# EasyEDA Pro project ProPrj_STM32电源板第二版_2025-04-22.epro, board PCB1
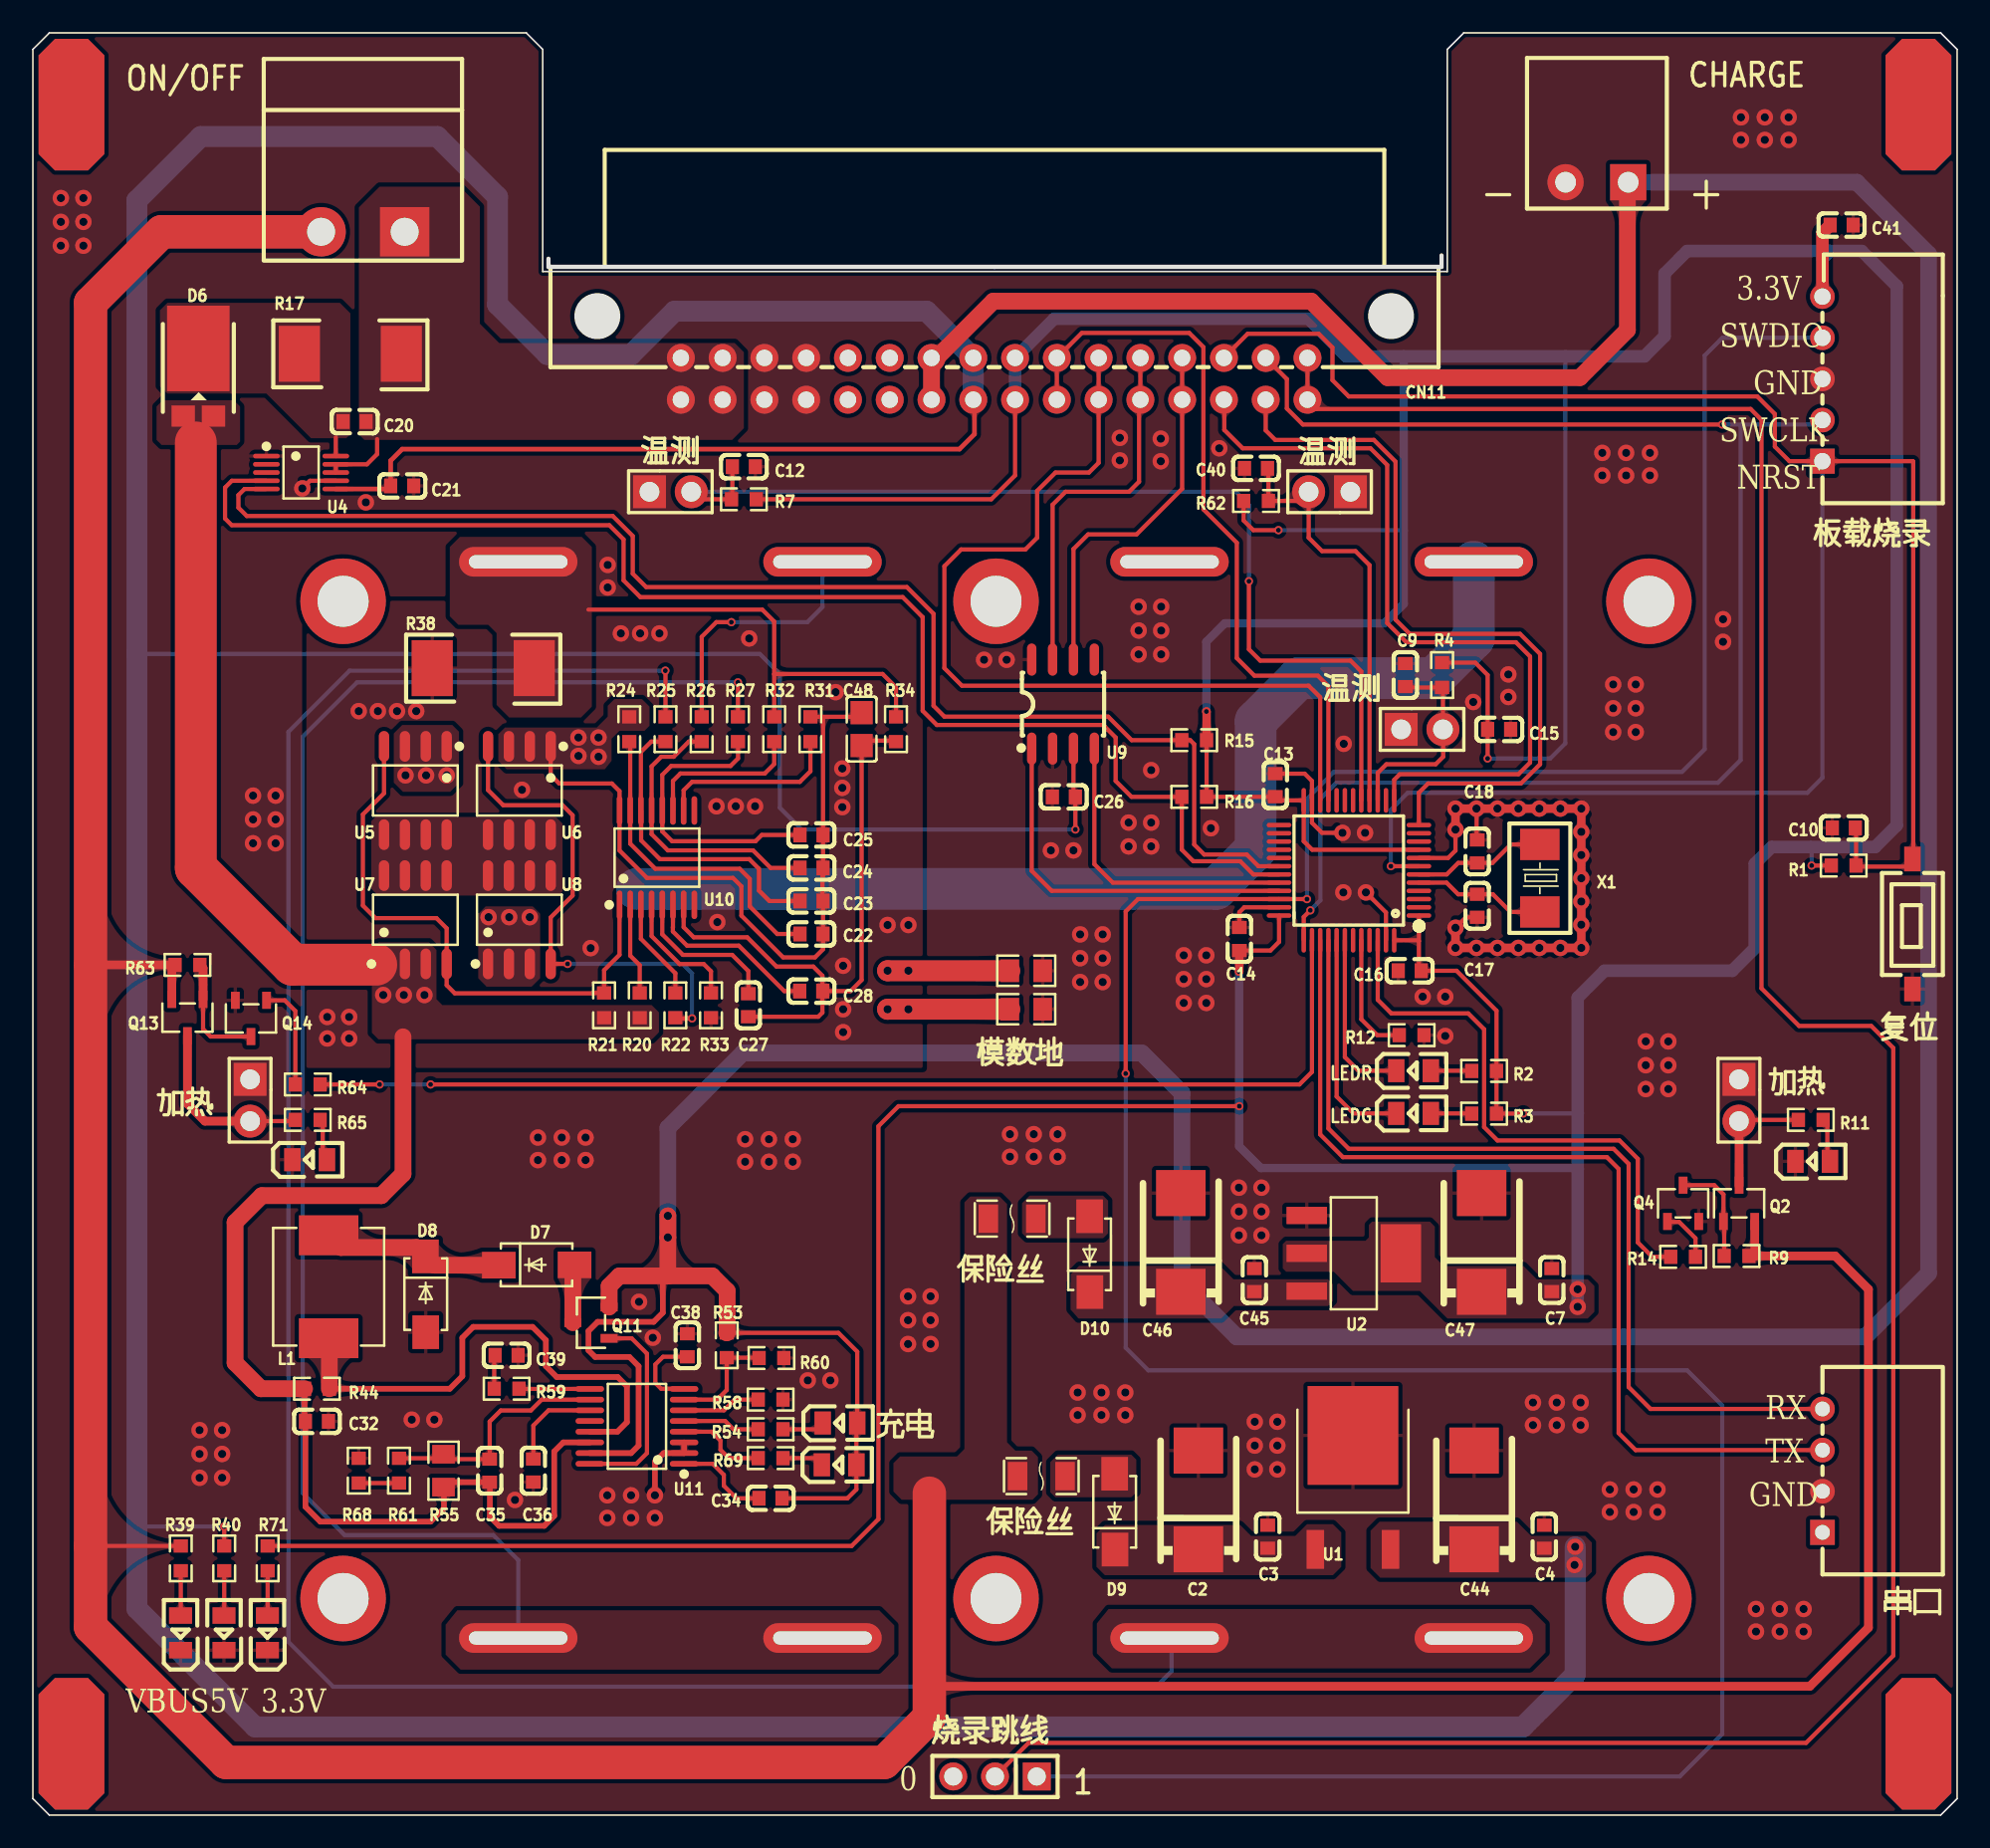
[diagram p1: board, top side]
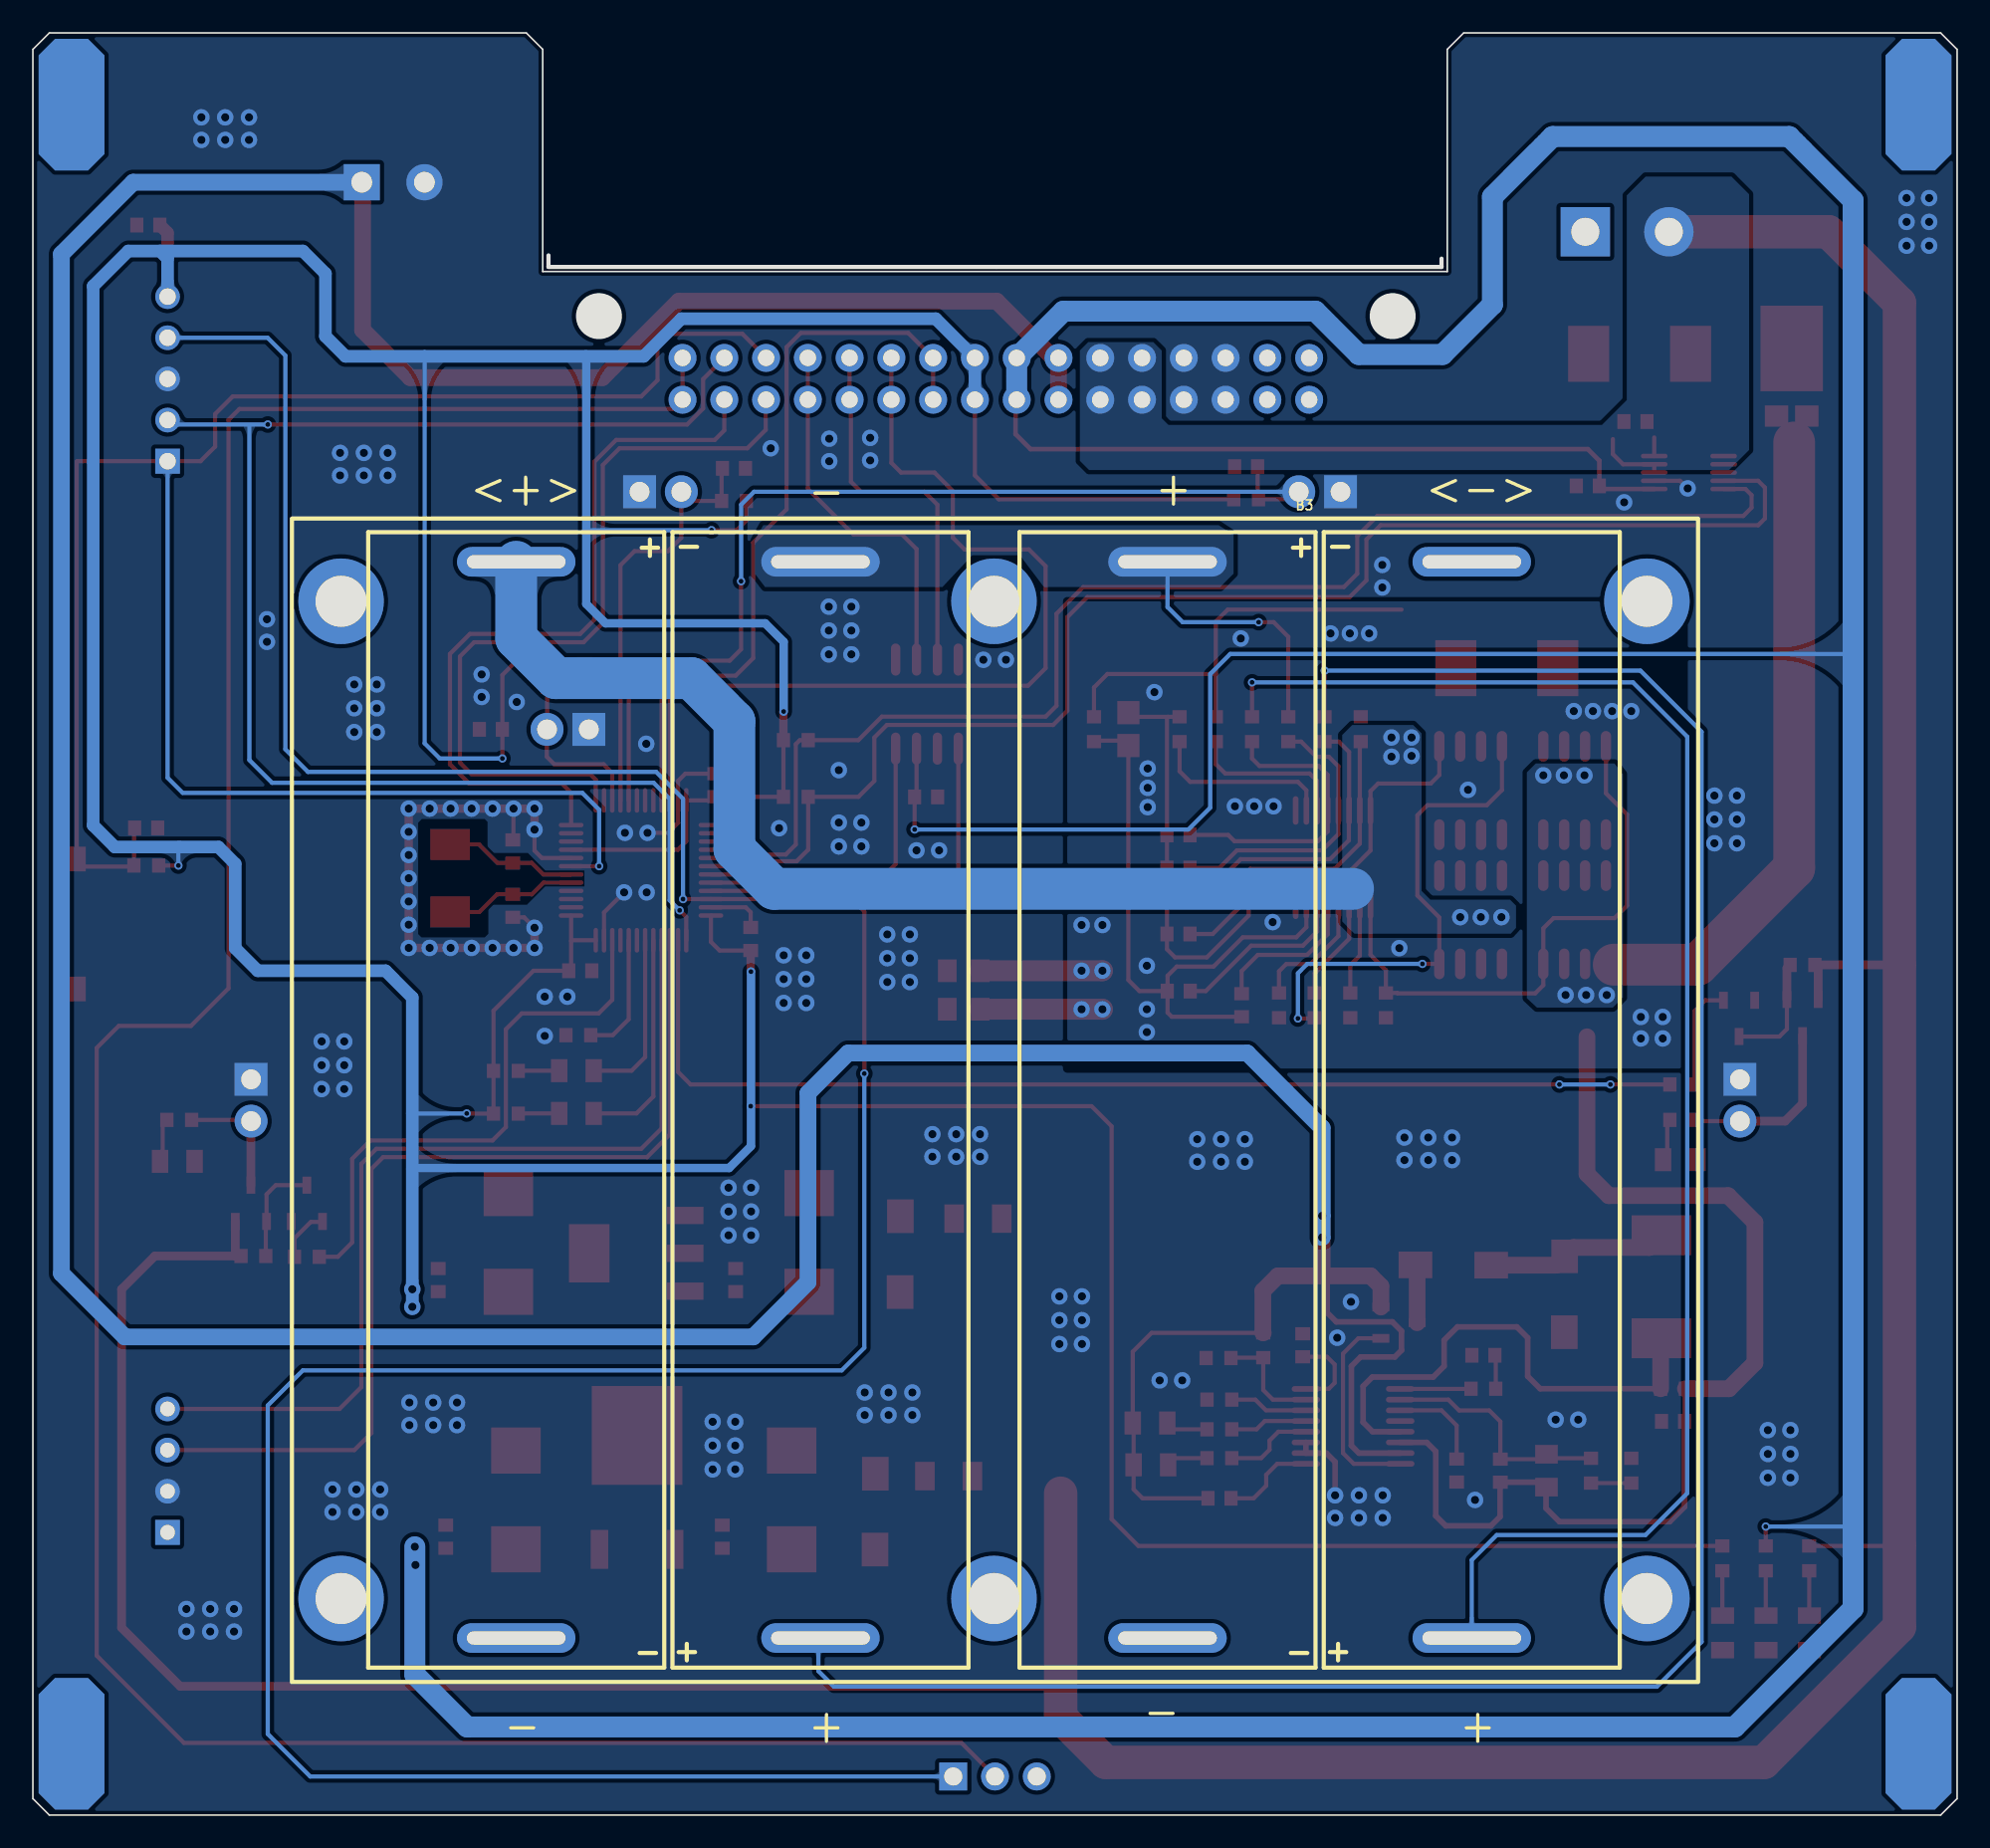
[diagram p2: board, bottom side, seen from below]

Outline 117 x 108.3 mm; copper layers: Top Layer, Bottom Layer. Coordinates in mm from the lower left corner of the outline.
Outline path: 0,1 0,107.3 1,108.3 30,108.3 31,107.3 31,93.8 86,93.8 86,107.3 87,108.3 116,108.3 117,107.3 117,1 116,0 1,0 0,1
Stack: Top Layer 0.035mm / Dielectric1 1.51mm FR4 er 4.5 / Bottom Layer 0.035mm

## Design rules (mm)
net $1N4673: DP1
net $1N4664: DP1
net CAN_H: DP3
net CAN_L: DP3
template: 自定义配置
spacing copperThickness1oz (default): track to track 0.102, other pairs 0.152 to 0.3
spacing copperThickness2oz: track to track 0.203, other pairs 0.152 to 0.3
track width copperThickness1oz (default): min 0.127, default 0.254, max 2.54
track width copperThickness2oz: min 0.203, default 0.254, max 2.54
differential pair differentialPair (default): width min 0.127, default 0.254, max 2.54; gap min 0.152, default 0.152
via viaSize (default): diameter min 0.5, default 0.61, max 10; hole min 0.3, default 0.305, max 6.3

## Placement (name value [footprint] x y rotation side)
B1  -  [18650_ZHIHAN]  87.61 76.16 270 bottom
B2  -  [18650_ZHIHAN]  69.11 10.76 90 bottom
B3  -  [18650_ZHIHAN]  48.01 76.16 270 bottom
B4  -  [18650_ZHIHAN]  29.51 10.76 90 bottom
C2  47uF  [CASE-D_7343]  70.87 19.15 270 top
C3  10uF  [C0603]  75.08 16.92 270 top
C4  10uF  [C0603]  91.9 16.92 270 top
C7  10uF  [C0603]  92.35 32.51 270 top
C9  10uF  [C0603]  83.45 69.28 270 top
C10  100nF  [C0603]  110.11 59.99 0 top
C12  10uF  [C0603]  43.23 81.94 180 top
C13  100nF  [C0603]  75.54 62.59 270 top
C14  100nF  [C0603]  73.36 53.24 270 top
C15  100nF  [C0603]  89.15 65.98 180 top
C16  100nF  [C0603]  83.72 51.31 0 top
C17  20pF  [C0603]  87.82 55.26 90 top
C18  20pF  [C0603]  87.82 58.56 270 top
C20  100nF  [C0603]  19.56 84.68 180 top
C21  100nF  [C0603]  22.45 80.77 180 top
C22  100nF  [C0603]  47.34 53.54 0 top
C23  100nF  [C0603]  47.34 55.55 0 top
C24  100nF  [C0603]  47.34 57.55 0 top
C25  100nF  [C0603]  47.34 59.56 0 top
C26  100nF  [C0603]  62.69 61.87 0 top
C27  100nF  [C0603]  43.5 49.21 90 top
C28  100nF  [C0603]  47.33 50.07 180 top
C32  10uF  [C0603]  17.27 23.93 180 top
C34  100nF  [C0603]  44.85 19.25 180 top
C35  1.3pF  [C0603]  27.77 20.93 270 top
C36  100nF  [C0603]  30.43 20.94 90 top
C38  470pF  [C0603]  39.79 28.55 270 top
C39  220nF  [C0603]  28.8 27.94 180 top
C40  10uF  [C0603]  74.37 81.84 0 top
C41  100nF  [C0603]  109.98 96.62 0 top
C44  47uF  [CASE-D_7343]  87.63 19.15 270 top
C45  10uF  [C0603]  74.27 32.51 270 top
C46  47uF  [CASE-D_7343]  69.8 34.8 270 top
C47  47uF  [CASE-D_7343]  88.09 34.8 270 top
C48  2.2uF  [C0805]  50.39 65.99 90 top
CN2  WJ2EDGRC-5.08-2P  [CONN-TH_2P-P5.08_WJ2EDGRC-5.08-2P]  20.07 96.22 180 top
CN7  WJ15EDGRC-3.81-2P  [CONN-TH_2P-P3.81_WJ15EDGRC-3.81-2P]  95.1 99.23 180 top
CN10  ZX-XH2.54-4PWZ  [CONN-TH_4P-P2.50_ZX-XH2.54-4PWZ]  108.81 20.93 90 top
CN11  9001-35321C00A  [CONN-TH_32P-P2.54_9001-35321C00A]  58.45 87.28 180 top
D6  SB1045L  [TO-277_3P-L5.4-W4.0-LS6.5-TR]  10.06 87.07 270 top
D7  SS24  [SMA_L4.3-W2.6-LS5.0-FD]  30.63 33.43 180 top
D8  SS24  [SMA_L4.3-W2.6-LS5.0-FD]  23.88 31.65 90 top
D9  SS24  [SMA_L4.3-W2.6-LS5.0-FD]  65.79 18.44 270 top
D10  SS24  [SMA_L4.3-W2.6-LS5.0-FD]  64.26 34.09 270 top
F1  JFC1206-1200FS  [F1206]  61.32 20.6 0 top
F2  JFC1206-1100FS  [F1206]  59.54 36.25 0 top
H3  PZ254V-11-02P  [HDR-TH_2P-P2.54-V-M]  84.47 65.98 0 top
H6  PZ254V-11-02P  [HDR-TH_2P-P2.54-V-M]  38.76 80.42 0 top
H8  PZ254V-11-02P  [HDR-TH_2P-P2.54-V-M]  103.73 43.44 270 top
H9  PZ254V-11-02P  [HDR-TH_2P-P2.54-V-M]  78.84 80.42 180 top
H10  PZ254V-11-02P  [HDR-TH_2P-P2.54-V-M]  13.21 43.44 270 top
H12  PZ254V-11-03P  [HDR-TH_3P-P2.54-V-M]  58.5 2.35 180 top
L1  33uH  [IND-SMD_L7.0-W6.6_FXL0630]  17.98 32.11 90 top
LED19  KT-0805Y  [LED0805-R-RD]  8.98 11.07 90 top
LED20  KT-0805Y  [LED0805-R-RD]  11.62 11.07 90 top
LED21  KT-0805Y  [LED0805-R-RD]  14.26 11.07 90 top
LED22  KT-0805G  [LED0805-R-RD]  83.95 42.64 0 top
LED23  KT-0805G  [LED0805-R-RD]  49.07 23.83 0 top
LED24  NCD0805R1  [LED0805-R-RD]  49.02 21.29 0 top
LED25  NCD0805R1  [LED0805-R-RD]  83.95 45.23 0 top
LED26  NCD0805R1  [LED0805-R-RD]  108.22 39.73 0 top
LED27  NCD0805R1  [LED0805-R-RD]  16.83 39.83 0 top
NOREF  -  [Pad_ie14815]  2.35 103.94 0 top
NOREF#2  -  [Pad_e20]  98.26 73.76 90 top
NOREF#3  -  [Pad_e2]  18.86 73.76 90 top
NOREF#4  -  [Pad_e21]  98.26 13.16 90 top
NOREF#5  -  [Pad_e4]  58.56 73.76 90 top
NOREF#6  -  [Pad_ie14791]  114.65 4.34 0 top
NOREF#7  -  [Pad_ie14798]  114.65 103.94 0 top
NOREF#8  -  [Pad_e5]  58.56 13.16 90 top
NOREF#9  -  [Pad_e3]  18.86 13.16 90 top
NOREF#10  -  [Pad_ie9857]  2.35 4.34 0 top
Q2  SI2301CDS-T1-GE3  [SOT-23-3_L3.0-W1.7-P0.95-LS2.9-BR]  103.74 37.18 270 top
Q4  S8050 J3Y(RANGE:200-350)  [SOT-23-3_L3.0-W1.7-P0.95-LS2.9-BR]  100.34 37.18 270 top
Q11  SI2301CDS-T1-GE3  [SOT-23-3_L3.0-W1.7-P0.95-LS2.9-BR]  33.93 29.92 0 top
Q13  SI2301CDS-T1-GE3  [SOT-23-3_L3.0-W1.7-P0.95-LS2.9-BR]  9.4 48.46 90 top
Q14  S8050 J3Y(RANGE:200-350)  [SOT-23-3_L3.0-W1.7-P0.95-LS2.9-BR]  13.26 48.41 90 top
R1  10kΩ  [R0603]  110.1 57.7 180 top
R2  1kΩ  [R0603]  88.24 45.22 0 top
R3  1kΩ  [R0603]  88.24 42.63 0 top
R4  10kΩ  [R0603]  85.69 69.28 90 top
R7  10kΩ  [R0603]  43.23 79.96 0 top
R9  20kΩ  [R0603]  103.59 33.98 0 top
R11  10kΩ  [R0603]  108.1 42.25 0 top
R12  10kΩ  [R0603]  83.83 47.4 0 top
R14  10kΩ  [R0603]  100.34 33.92 180 top
R15  4.7kΩ  [R0603]  70.61 65.32 0 top
R16  4.7kΩ  [R0603]  70.61 61.88 0 top
R17  5mΩ  [RES-SMD_L6.4-W3.2-1]  19.3 88.8 0 top
R20  5.1kΩ  [R0603]  36.9 49.21 270 top
R21  1MΩ  [R0603]  34.73 49.21 90 top
R22  5.1kΩ  [R0603]  39.06 49.21 90 top
R24  1kΩ  [R0603]  36.26 65.99 270 top
R25  1kΩ  [R0603]  38.46 65.99 270 top
R26  1kΩ  [R0603]  40.67 65.99 270 top
R27  1kΩ  [R0603]  42.87 65.99 270 top
R31  1kΩ  [R0603]  47.28 65.99 270 top
R32  1kΩ  [R0603]  45.07 65.99 270 top
R33  1kΩ  [R0603]  41.23 49.21 90 top
R34  5.1kΩ  [R0603]  52.48 65.99 270 top
R38  5mΩ  [RES-SMD_L6.4-W3.2-1]  27.38 69.7 0 top
R39  10kΩ  [R0603]  8.99 15.6 270 top
R40  4.7kΩ  [R0603]  11.63 15.6 270 top
R44  200mΩ  [R0603]  17.27 25.91 0 top
R53  30kΩ  [R0603]  42.19 28.55 90 top
R54  10kΩ  [R0603]  44.86 23.44 0 top
R55  68kΩ  [R0805]  24.97 20.93 90 top
R58  10kΩ  [R0603]  44.86 25.25 0 top
R59  120Ω  [R0603]  28.8 25.91 180 top
R60  2.7kΩ  [R0603]  44.91 27.77 180 top
R61  10kΩ  [R0603]  22.26 20.93 270 top
R62  10kΩ  [R0603]  74.37 79.86 180 top
R63  20kΩ  [R0603]  9.4 51.66 180 top
R64  10kΩ  [R0603]  16.71 44.4 0 top
R65  10kΩ  [R0603]  16.71 42.25 0 top
R67  0Ω  [R0805]  60.4 51.31 0 top
R68  1.5kΩ  [R0603]  19.81 20.93 90 top
R69  10kΩ  [R0603]  44.86 21.69 0 top
R70  0Ω  [R0805]  60.4 48.97 0 top
R71  1kΩ  [R0603]  14.28 15.6 90 top
SW1  TS-1092S-B3D2-G  [SW-SMD_L6.1-W3.6-LS7.9]  114.28 54.15 90 top
U1  CJ7805 3%  [TO-252-2_L6.6-W6.1-P4.58-LS10.1-BR-CW]  80.26 19.61 270 top
U2  AMS1117-3.3  [SOT-223_L6.5-W3.5-P2.30-LS7.0-BR]  80.31 34.14 180 top
U3  STM32F091CCT6  [LQFP-48_L7.0-W7.0-P0.50-LS9.0-BL]  80.02 57.41 90 top
U4  INA226AIDGSR  [MSOP-10_L3.0-W3.0-P0.50-LS5.0-BL]  16.31 81.58 270 top
U5  AO4407  [SOP-8_L4.9-W3.9-P1.27-LS6.0-BL-1]  23.26 62.26 180 top
U6  AO4407  [SOP-8_L4.9-W3.9-P1.27-LS6.0-BL-1]  29.58 62.26 180 top
U7  AO4407  [SOP-8_L4.9-W3.9-P1.27-LS6.0-BL-1]  23.26 54.41 0 top
U8  AO4407  [SOP-8_L4.9-W3.9-P1.27-LS6.0-BL-1]  29.58 54.41 0 top
U9  TJA1050T/CM,118  [SOIC-8_L5.0-W4.0-P1.27-LS6.0-BL]  62.64 67.51 0 top
U10  FM8254AAV  [TSSOP-16_L5.0-W4.4-P0.65-LS6.4-BL]  37.94 58.18 0 top
U11  CN3722  [TSSOP-16_L5.0-W4.4-P0.65-LS6.4-BL]  36.73 23.62 90 top
U12  ZX-XH2.54-5PWZ  [CONN-TH_ZX-XH2.54-5PWZ]  108.81 87.27 90 top
X1  8MHz  [CRYSTAL-SMD_L5.0-W3.2]  91.63 56.93 90 top

## Footprints (pads in the part's own frame, mm; a bottom-side part is the same pattern mirrored in y, then rotated)
18650_ZHIHAN
  oval 1.8x7.2 hole 0.8x6: 1(0,0) 2(65.4,0)
C0603
  rect 0.8x0.9 smd: 1(-0.7,0) 2(0.7,0)
C0805
  rect 1.41x1.35 smd: 1(-1,0) 2(1,0)
CASE-D_7343
  rect 2.799x3.01 smd: 1(3,0) 2(-3,0)
CONN-TH_2P-P3.81_WJ15EDGRC-3.81-2P
  rect 2.2x2.2 hole 1.26: 1(-1.905,0)
  round 2.2 hole 1.26: 2(1.905,0)
CONN-TH_2P-P5.08_WJ2EDGRC-5.08-2P
  rect 3x3 hole 1.7: 1(-2.54,0)
  round 3 hole 1.7: 2(2.54,0)
CONN-TH_4P-P2.50_ZX-XH2.54-4PWZ
  rect 1.524x1.5 hole 0.9: 1(-3.75,0)
  round 1.5 hole 0.9: 2(-1.25,0) 3(1.25,0) 4(3.75,0)
CONN-TH_32P-P2.54_9001-35321C00A
  round 1.7 hole 1: a1(19.05,-1.27) a2(16.51,-1.27) a3(13.97,-1.27) a4(11.43,-1.27) a5(8.89,-1.27) a6(6.35,-1.27) a7(3.81,-1.27) a8(1.27,-1.27) a9(-1.27,-1.27) a10(-3.81,-1.27) a11(-6.35,-1.27) a12(-8.89,-1.27) a13(-11.43,-1.27) a14(-13.97,-1.27) a15(-16.51,-1.27) a16(-19.05,-1.27) b1(19.05,1.27) b2(16.51,1.27) b3(13.97,1.27) b4(11.43,1.27) b5(8.89,1.27) b6(6.35,1.27) b7(3.81,1.27) b8(1.27,1.27) b9(-1.27,1.27) b10(-3.81,1.27) b11(-6.35,1.27) b12(-8.89,1.27) b13(-11.43,1.27) b14(-13.97,1.27) b15(-16.51,1.27) b16(-19.05,1.27)
CONN-TH_ZX-XH2.54-5PWZ
  rect 1.524x1.5 hole 1: 1(-5,0)
  round 1.5 hole 1: 2(-2.5,0) 3(0,0) 4(2.5,0) 5(5,0)
CRYSTAL-SMD_L5.0-W3.2
  rect 1.9x2.4 smd: 1(-2.05,0) 2(2.05,0)
F1206
  rect 1.19x1.728 smd: 1(-1.445,0) 2(1.445,0)
HDR-TH_2P-P2.54-V-M
  rect 2x2 hole 1.2: 1(-1.27,0)
  round 2 hole 1.2: 2(1.27,0)
HDR-TH_3P-P2.54-V-M
  rect 1.7x1.7 hole 1.1: 1(-2.54,0)
  round 1.7 hole 1.1: 2(0,0) 3(2.54,0)
IND-SMD_L7.0-W6.6_FXL0630
  rect 2.424x3.62 smd: 1(3.128,0) 2(-3.128,0)
LED0805-R-RD
  rect 1x1.399 smd: 1(1.05,0) 2(-1.05,0)
LQFP-48_L7.0-W7.0-P0.50-LS9.0-BL
  oval 0.27x1.5 smd: 1(-2.75,-4.25) 2(-2.25,-4.25) 3(-1.75,-4.25) 4(-1.25,-4.25) 5(-0.75,-4.25) 6(-0.25,-4.25) 7(0.25,-4.25) 8(0.75,-4.25) 9(1.25,-4.25) 10(1.75,-4.25) 11(2.25,-4.25) 12(2.75,-4.25) 25(2.75,4.25) 26(2.25,4.25) 27(1.75,4.25) 28(1.25,4.25) 29(0.75,4.25) 30(0.25,4.25) 31(-0.25,4.25) 32(-0.75,4.25) 33(-1.25,4.25) 34(-1.75,4.25) 35(-2.25,4.25) 36(-2.75,4.25)
  oval 1.5x0.27 smd: 13(4.25,-2.75) 14(4.25,-2.25) 15(4.25,-1.75) 16(4.25,-1.25) 17(4.25,-0.75) 18(4.25,-0.25) 19(4.25,0.25) 20(4.25,0.75) 21(4.25,1.25) 22(4.25,1.75) 23(4.25,2.25) 24(4.25,2.75) 37(-4.25,2.75) 38(-4.25,2.25) 39(-4.25,1.75) 40(-4.25,1.25) 41(-4.25,0.75) 42(-4.25,0.25) 43(-4.25,-0.25) 44(-4.25,-0.75) 45(-4.25,-1.25) 46(-4.25,-1.75) 47(-4.25,-2.25) 48(-4.25,-2.75)
MSOP-10_L3.0-W3.0-P0.50-LS5.0-BL
  oval 0.28x1.62 smd: 1(-1,-2.11) 2(-0.5,-2.11) 3(0,-2.11) 4(0.5,-2.11) 5(1,-2.11) 6(1,2.11) 7(0.5,2.11) 8(0,2.11) 9(-0.5,2.11) 10(-1,2.11)
Pad_e2
  round 5.2 hole 3.1: 1(0,0)
Pad_e3
  round 5.2 hole 3.1: 1(0,0)
Pad_e4
  round 5.2 hole 3.1: 1(0,0)
Pad_e5
  round 5.2 hole 3.1: 1(0,0)
Pad_e20
  round 5.2 hole 3.1: 1(0,0)
Pad_e21
  round 5.2 hole 3.1: 1(0,0)
Pad_ie9857
  custom 4x8 hole 0.254: 0(0,0)
Pad_ie14791
  custom 4x8 hole 0.254: 0(0,0)
Pad_ie14798
  custom 4x8 hole 0.254: 0(0,0)
Pad_ie14815
  custom 4x8 hole 0.254: 0(0,0)
R0603
  rect 0.806x0.864 smd: 1(-0.753,0) 2(0.753,0)
R0805
  rect 1.133x1.377 smd: 1(-1,0) 2(1,0)
RES-SMD_L6.4-W3.2-1
  rect 2.5x3.4 smd: 1(-3.1,0) 2(3.1,0)
SMA_L4.3-W2.6-LS5.0-FD
  rect 2.046x1.62 smd: 1(-2.304,-0.009) 2(2.304,0.009)
SOIC-8_L5.0-W4.0-P1.27-LS6.0-BL
  oval 0.569x1.95 smd: 1(-1.905,-2.705) 2(-0.635,-2.705) 3(0.635,-2.705) 4(1.905,-2.705) 5(1.905,2.705) 6(0.635,2.705) 7(-0.635,2.705) 8(-1.905,2.705)
SOP-8_L4.9-W3.9-P1.27-LS6.0-BL-1
  oval 0.63x1.865 smd: 1(-1.905,-2.683) 2(-0.635,-2.683) 3(0.635,-2.683) 4(1.905,-2.683) 5(1.905,2.683) 6(0.635,2.683) 7(-0.635,2.683) 8(-1.905,2.683)
SOT-23-3_L3.0-W1.7-P0.95-LS2.9-BR
  rect 1.038x0.532 smd: 1(1.101,-0.95) 2(1.101,0.95) 3(-1.101,0)
SOT-223_L6.5-W3.5-P2.30-LS7.0-BR
  rect 2.465x1.05 smd: 1(2.857,-2.3) 2(2.857,0) 3(2.857,2.3)
  rect 2.465x3.54 smd: 4(-2.857,0)
SW-SMD_L6.1-W3.6-LS7.9
  rect 1.5x1 smd: 1(-3.95,0) 2(3.95,0)
TO-252-2_L6.6-W6.1-P4.58-LS10.1-BR-CW
  rect 2.364x1.064 smd: 1(3.462,-2.286) 3(3.462,2.286)
  rect 6.004x5.512 smd: 2(-3.462,0)
TO-277_3P-L5.4-W4.0-LS6.5-TR
  rect 1.29x1.423 smd: 1(2.054,0.92) 3(2.054,-0.92)
  rect 5.2x3.8 smd: 2(-2.054,0)
TSSOP-16_L5.0-W4.4-P0.65-LS6.4-BL
  oval 0.343x1.732 smd: 1(-2.275,-2.866) 2(-1.625,-2.866) 3(-0.975,-2.866) 4(-0.325,-2.866) 5(0.325,-2.866) 6(0.975,-2.866) 7(1.625,-2.866) 8(2.275,-2.866) 9(2.275,2.866) 10(1.625,2.866) 11(0.975,2.866) 12(0.325,2.866) 13(-0.325,2.866) 14(-0.975,2.866) 15(-1.625,2.866) 16(-2.275,2.866)

## Nets
As in the schematic.

Pads without a net: CN10 1; H12 3; NOREF 0; NOREF#2 1; NOREF#3 1; NOREF#4 1; NOREF#5 1; NOREF#6 0; NOREF#7 0; NOREF#8 1; NOREF#9 1; NOREF#10 0; U3 2 3 4 10 11 14 18 19 20 25 26 27 28 29 43 45; U4 3; U9 5; U10 8 9; U11 12

## Via types
v1: diameter 0.5, hole 0.3, Top Layer to Bottom Layer, 22 vias
v2: diameter 1, hole 0.5, Top Layer to Bottom Layer, 236 vias

## Routing (per net, layer and track width the routed paths; a pad name or vN(x,y) marks a point on that pad's centre or on a via; arc(x,y) is an arc through that point)
AGND: length 14.9
  Top Layer w1.27: v2(51.97,48.97) 51.97,48.97 R70.1 ; R67.1 51.97,51.31 v2(51.97,51.31)
  vias: v2(17.9,48.5) v2(17.9,47.19) v2(19.23,48.5) v2(19.23,47.19) v2(19.81,67.09) v2(20.98,67.09) v2(22.14,67.09) v2(23.31,67.09) v2(29.74,62.31) v2(33.92,52.68) v2(35.75,71.81) v2(36.92,71.81) v2(38.1,71.81) v2(41.57,61.3) v2(41.62,54.26) v2(42.74,61.3) v2(43.56,71.5) v2(43.91,61.3) v2(48.81,68.24) v2(49.22,63.6) v2(49.22,62.42) v2(49.22,61.25) v2(49.27,51.61) v2(49.27,48.97) v2(49.27,47.58) v2(51.97,54.09) v2(53.23,54.09) v2(53.23,51.31) v2(53.23,48.97)
GND: length 54.4
  Top Layer w0.254: v2(81.05,56.07) 82.27,54.85 U3.47 ; U4.7 16.85,81.08 v2(16.38,80.62) ; U3.35 73.65,55.16 73.36,54.86 C14.1 ; 87.92,59.26 87.78,59.4 87.78,61.15 v2(87.77,61.16) ; v2(79.63,59.69) 78.38,59.69 77.77,60.3 U3.23 77.77,62.84 77.33,63.29 C13.1 ; v2(86.5,59.89) 86.5,58.61 86.05,58.16 U3.8 ; C17.1 87.14,54.56 v2(86.5,53.92)
  Top Layer w0.343: v2(37.82,19.43) 37.82,21.46 38.35,22 U11.2 U11.3
  Top Layer w0.508: v2(86.5,59.89) v2(86.5,61.16) v2(87.77,61.16) v2(89.05,61.16) v2(90.32,61.16) v2(91.6,61.16) v2(92.87,61.16) v2(94.15,61.16) v2(94.15,59.75) v2(94.15,58.34) v2(94.15,56.93) v2(94.15,55.52) v2(94.15,54.11) v2(94.15,52.7) v2(92.87,52.7) v2(91.6,52.7) v2(90.32,52.7) v2(89.05,52.7) v2(87.77,52.7) v2(86.5,52.7) v2(86.5,53.92)
  vias: v2(1.7,98.26) v2(1.7,96.82) v2(1.7,95.37) v2(3.07,98.26) v2(3.07,96.82) v2(3.07,95.37) v2(10.14,23.39) v2(10.14,21.95) v2(10.14,20.5) v2(11.51,23.39) v2(11.51,21.95) v2(11.51,20.5) v2(13.39,61.95) v2(13.39,60.5) v2(13.39,59.06) v2(14.76,61.95) v2(14.76,60.5) v2(14.76,59.06) v2(20.24,79.77) v2(23.04,24.03) v2(24.41,24.03) v2(29.31,19.15) v2(30.71,41.17) v2(30.71,39.8) v2(32.16,41.17) v2(32.16,39.8) v2(33.6,41.17) v2(33.6,39.8) v2(34.92,19.43) v2(34.92,18.06) v2(34.95,75.97) v2(34.95,74.6) v2(36.37,19.43) v2(36.37,18.06) v2(36.86,31.19) v2(37.69,29.01) v2(37.82,18.06) v2(43.31,41.07) v2(43.31,39.7) v2(44.75,41.07) v2(44.75,39.7) v2(46.2,41.07) v2(46.2,39.7) v2(47.12,26.42) v2(48.49,26.42) v2(53.21,31.52) v2(53.21,30.07) v2(53.21,28.63) v2(54.59,31.52) v2(54.59,30.07) v2(54.59,28.63) v2(57.84,70.21) v2(59.21,70.21) v2(59.41,41.38) v2(59.41,40.01) v2(60.86,41.38) v2(60.86,40.01) v2(61.9,58.62) v2(62.31,41.38) v2(62.31,40.01) v2(63.27,58.62) v2(63.53,25.68) v2(63.53,24.31) v2(63.68,53.52) v2(63.68,52.07) v2(63.68,50.62) v2(64.97,25.68) v2(64.97,24.31) v2(65.05,53.52) v2(65.05,52.07) v2(65.05,50.62) v2(66.09,83.69) v2(66.09,82.32) v2(66.42,25.68) v2(66.42,24.31) v2(66.62,60.31) v2(66.62,58.86) v2(67.23,73.43) v2(67.23,71.98) v2(67.23,70.54) v2(68,63.5) v2(68,60.31) v2(68,58.86) v2(68.58,83.64) v2(68.58,82.27) v2(68.61,73.43) v2(68.61,71.98) v2(68.61,70.54) v2(69.98,52.25) v2(69.98,50.8) v2(69.98,49.35) v2(71.35,52.25) v2(71.35,50.8) v2(71.35,49.35) v2(71.63,59.97) v2(72.14,83.06) v2(73.33,38.13) v2(73.33,36.68) v2(73.33,35.23) v2(74.29,23.9) v2(74.29,22.45) v2(74.29,21.01) v2(74.7,38.13) v2(74.7,36.68) v2(74.7,35.23) v2(75.67,23.9) v2(75.67,22.45) v2(75.67,21.01) v2(79.71,65.1) v2(79.68,56.07) v2(81,59.69) v2(84.51,49.73) v2(85.88,49.73) v2(85.88,47.35) v2(87.58,67.64) v2(89.71,69.32) v2(89.71,67.95) v2(91.21,25.07) v2(91.21,23.7) v2(92.66,25.07) v2(92.66,23.7) v2(94.11,25.07) v2(94.11,23.7) v2(95.43,82.78) v2(95.43,81.41) v2(95.88,19.79) v2(95.88,18.42) v2(96.09,68.71) v2(96.09,67.26) v2(96.09,65.81) v2(96.88,82.78) v2(96.88,81.41) v2(97.33,19.79) v2(97.33,18.42) v2(97.46,68.71) v2(97.46,67.26) v2(97.46,65.81) v2(98.07,47.02) v2(98.07,45.57) v2(98.07,44.12) v2(98.32,82.78) v2(98.32,81.41) v2(98.78,19.79) v2(98.78,18.42) v2(99.44,47.02) v2(99.44,45.57) v2(99.44,44.12) v2(102.77,72.67) v2(102.77,71.3) v2(103.86,103.17) v2(103.86,101.8) v2(104.77,12.52) v2(104.77,11.15) v2(105.31,103.17) v2(105.31,101.8) v2(106.22,12.52) v2(106.22,11.15) v2(106.76,103.17) v2(106.76,101.8) v2(107.67,12.52) v2(107.67,11.15)
V3.3V: length 417.4
  Top Layer w0.254: U3.48 84.22,53.16 84.27,53.11 ; R4.2 87.7,70.03 88.45,69.28 C15.2 v1(88.45,64.21) ; 84.27,53.11 84.27,51.45 C16.2 86.56,51.31 88.99,48.88 R3.2 90.61,42.63 v1(90.62,42.64) ; 84.27,53.11 U3.1 ; U3.36 75.77,53.07 75.25,52.54 C14.2 ; R1.2 v1(108.15,57.7) ; R15.2 R16.2 75.53,61.88 C13.2 75.76,61.66 U3.24 77.27,59.18 77.79,58.66 U3.9 ; v1(73.36,43.08) 52.63,43.08 51.41,41.86 51.41,17.98 49.78,16.35 R71.2 ; CN11.b9 59.72,81.41 58.27,79.96 R7.2 ; R62.2 73.62,78.67 74.21,78.08 v1(75.74,78.08)
  Top Layer w0.508: R15.2 71.37,67.05 v1(71.35,67.06) ; v1(73.34,51.26) 73.36,51.27 C14.2
  Top Layer w0.762: U12.5 108.81,96.15 C41.1
  Bottom Layer w0.254: 93.18,88.89 93.18,65.13 92.26,64.21 v1(88.45,64.21) ; 93.93,42.64 93.93,42.64 v1(90.62,42.64) ; 83.35,78.06 83.33,78.08 v1(75.74,78.08) ; 108.12,58.83 108.15,58.79 v1(108.15,57.7)
  Bottom Layer w0.508: 83.35,88.65 83.35,73.6 82.17,72.42 72.47,72.42 71.35,71.3 v1(71.35,67.06) ; 93.93,39.26 93.87,39.32 74.66,39.32 73.34,40.65 v1(73.34,51.26)
  Bottom Layer w0.762: 109.27,95.05 108.81,94.59 U12.5 ; 109.27,95.05 100.58,95.05 99.21,93.68 99.21,89.87 97.99,88.65 79.86,88.65 77.57,90.93 62.1,90.93 CN11.a9 CN11.b9 ; 109.27,95.05 111.2,95.05 113.34,92.91 113.34,60.15 112.01,58.83 105.72,58.83 104.7,57.81 104.7,52.68 103.33,51.31 95.56,51.31 93.93,49.68 v2(93.93,31.95) v2(93.93,30.89)
V5V: length 372.6
  Top Layer w0.254: v1(63.39,59.89) C26.2 63.27,61.99 U9.3 ; R40.1 v1(11.63,17.53)
  Top Layer w0.28: CN11.b8 57.25,85.94 57.25,83.92 56.34,83.01 22.45,83.01 21.75,82.31 C21.2 21.57,80.58 U4.6
  Bottom Layer w0.254: v1(63.39,59.89) 46.74,59.89 45.42,61.21 45.42,69.34 44.2,70.56 6.33,70.56 6.32,70.57 ; v1(11.63,17.53) 6.33,17.53 6.32,17.54
  Bottom Layer w1.27: v2(93.78,16.31) 93.78,8.53 90.6,5.36 13.52,5.36 6.32,12.55 6.32,98.12 10.21,102 24.59,102 28.25,98.34 28.25,91.79 31.29,88.75 36.38,88.75 39.01,91.39 54.34,91.39 CN11.a8 CN11.b8
  vias: v2(93.74,15.2)
VBUS: length 267.6
  Top Layer w0.254: R39.1 3.51,16.35
  Top Layer w0.531: Q13.2 8.45,51.47 8.64,51.66 3.51,51.66 3.51,51.66 ; Q2.2 104.69,33.98 104.69,33.98 ; 104.69,33.98 109.59,33.98 111.61,31.95 111.61,11.39 108.04,7.83 54.51,7.83 ; 104.69,33.98 R9.2
  Top Layer w2.032: 54.51,19.56 54.51,5.94 51.77,3.2 11.74,3.2 3.51,11.44 3.51,91.9 7.82,96.22 CN2.2
VCC: length 4.2
  Top Layer w0.254: 20.93,83.62 20.93,82.7 20.31,82.08 U4.9 U4.8
ADC5: length 12.5
  Top Layer w0.254: C9.2 83.5,68.52 R4.1 85.74,68.47 H3.2 85.75,65.96 85.75,64.31 85.29,63.86 82.3,63.86 81.77,63.33 U3.15
ADC6: length 26.2
  Top Layer w0.254: U3.16 81.27,75.95 80.42,76.81 78.38,76.81 77.57,77.62 H9.2 77.01,79.86 R62.1 75.12,81.79 C40.2
ADC7: length 62.9
  Top Layer w0.254: C12.2 42.53,80.01 R7.1 40.49,79.96 H6.2 ; v1(73.94,74.98) 73.94,70.84 74.63,70.15 80.11,70.15 80.77,69.49 U3.17
  Bottom Layer w0.254: v1(73.94,74.98) 73.94,79.63 73.15,80.42 H6.2
B1: length 95.4
  Top Layer w0.254: R27.1 v1(42.87,68.83)
  Bottom Layer w0.254: v1(42.87,68.83) 19.71,68.83 16.41,65.53 16.41,19.56 18.95,17.02 27.99,17.02 29.51,15.5 B4.1
B2: length 15.7
  Top Layer w0.254: v1(42.47,72.49) 41.55,72.49 40.67,71.6 R26.1
  Bottom Layer w0.254: v1(42.47,72.49) 47.09,72.49 48.01,73.41 B3.1
B3: length 139.9
  Top Layer w0.254: v1(38.46,69.55) 38.46,69.54 R25.1
  Bottom Layer w0.254: v1(38.46,69.55) 19.25,69.55 15.54,65.83 15.54,10.52 18.26,7.8 68.29,7.8 69.24,8.75 69.24,10.63 B2.1
B+: length 110
  Top Layer w0.254: 47.99,66.74 50.34,66.74 50.39,66.69 ; 47.99,66.74 48.04,66.68 C25.2 C24.2 48.04,57.09 48.01,57.05 48.01,55.58 C23.2 C22.2 48.04,52.62 47.55,52.12 45.62,52.12 43.08,54.66 43.08,56.44 42.57,56.95 37.34,56.95 35.67,58.62 35.67,62.22 35.2,62.69 32,62.69 31.48,63.21 U6.1 ; 47.99,66.74 R31.1
  Bottom Layer w2.54: B1.1 87.61,71.51 85.19,69.09 76.96,69.09 74.35,66.47 74.35,58.7 71.93,56.29 36.73,56.29
  vias: v2(27.71,54.57) v2(28.96,54.57) v2(30.21,54.57) v2(33.17,65.48) v2(33.17,64.36) v2(34.39,65.48) v2(34.39,64.31)
B-: length 26.9
  Top Layer w0.254: 45.07,69.33 45.07,72.53 44.35,73.25 33.78,73.25 ; 45.07,69.33 R32.1 ; 45.07,69.33 45.09,69.34 51.66,69.34 52.48,68.52 R34.1
CAN_H: length 22.8
  Top Layer w0.254: CN11.a12 CN11.b12 67.26,85.93 67.26,81.03 66.65,80.42 62.79,80.42 62,79.63 62,70.22
CAN_L: length 22.8
  Top Layer w0.254: 63.27,70.22 63.27,76.94 64.16,77.83 67.11,77.83 69.88,80.6 CN11.b13 CN11.a13
CAN_RX: length 18.7
  Top Layer w0.254: U3.32 65.66,56.66 64.54,57.79 U9.4
CAN_TX: length 23
  Top Layer w0.254: U9.1 60.73,57.38 61.95,56.16 U3.33
I2C_SCL_BUS: length 45.4
  Top Layer w0.254: U3.21 78.77,68.6 78.13,69.24 74.27,69.24 73.2,70.31 73.2,77.32 71.17,79.35 71.17,89.2 70.31,90.07 63.78,90.07 CN11.a10 CN11.b10
I2C_SDA_BUS: length 56.1
  Top Layer w0.254: U3.22 78.27,67.93 77.57,68.63 56.49,68.63 55.42,69.7 55.42,75.9 56.44,76.91 60.35,76.91 61.06,77.62 61.06,80.47 62.18,81.58 64.21,81.58 64.8,82.17 CN11.b11 CN11.a11
LEDG: length 13.5
  Top Layer w0.254: LED22.2 80.3,42.64 79.27,43.66 U3.41
LEDR: length 10.6
  Top Layer w0.254: U3.42 79.77,46.06 80.6,45.23 LED25.2
NRST: length 129.9
  Top Layer w0.254: U3.7 v1(82.57,57.66) ; C10.2 110.86,59.94 R1.1 110.92,57.64 114.33,57.64 114.33,82.25 114.31,82.27 U12.1 106.8,82.27 105.92,83.16 105.92,85.14 104.85,86.21 80.01,86.21 79.02,87.2 79.02,89.18 78.18,90.02 73.86,90.02 72.42,88.57 CN11.a14
  Bottom Layer w0.254: v1(82.57,57.66) 82.57,61.1 83.59,62.12 107.89,62.12 108.81,63.04 U12.1
P+: length 105.8
  Top Layer w0.343: U11.14 32.25,22.65 31.7,22.1 31.7,18.19 31.09,17.58 28.35,17.58 27.79,18.14 27.79,20.22 C35.2 25.27,20.23 R55.1 24.99,19.9 24.99,18.64 24.18,17.83 17.48,17.83 16.57,18.73 C32.2 16.52,23.98 R44.1
  Top Layer w1.016: 22.5,47.29 22.5,38.96 21.18,37.64 13.92,37.64 12.29,36.02 12.29,27.48 13.87,25.91 R44.1
  Top Layer w2.54: 20.88,51.68 15.78,51.68 9.91,57.55 9.91,83.41
  vias: v2(21.3,49.83) v2(22.56,49.83) v2(22.66,63.18) v2(23.81,49.83) v2(23.91,63.18) v2(25.16,63.18)
SCL1: length 83.1
  Top Layer w0.254: U4.5 12.87,80.58 12.5,80.21 12.5,79.45 13,78.94 35.26,78.94 36.47,77.72 36.47,75.44 37.29,74.63 53.14,74.63 54.76,73 54.76,67.41 55.42,66.75 65.38,66.75 66.81,65.32 R15.1 70.37,65.32 70.61,65.07 70.61,58.98 71.22,58.37 73.81,58.37 74.52,57.66 U3.30
SDA1: length 85.8
  Top Layer w0.254: U4.4 12.1,81.08 11.68,80.67 11.68,78.79 12.09,78.38 35.05,78.38 35.92,77.52 35.92,75.03 36.93,74.02 52.88,74.02 54.1,72.8 54.1,67.11 54.97,66.24 65.07,66.24 65.84,65.48 65.84,62.84 66.8,61.88 R16.1 69.86,58.67 70.56,57.96 73.41,57.96 74.21,57.16 U3.31
SW0: length 68.6
  Top Layer w0.254: R64.2 v1(21.08,44.4) ; v1(24.18,44.4) 77.01,44.4 77.77,45.16 U3.38
  Bottom Layer w0.254: v1(21.08,44.4) v1(24.18,44.4)
SW1: length 34.4
  Top Layer w0.254: U3.46 81.77,49.55 82.6,48.72 87.27,48.72 88.24,47.75 88.24,41.81 89.05,41 96.47,41 97.59,39.88 97.59,34.8 98.46,33.92 R14.2
SWCLK: length 92.6
  Top Layer w0.254: CN11.a15 76.25,87.26 76.25,85.48 77.22,84.5 v1(102.72,84.5) ; v1(77.67,54.98) 77.27,54.58 U3.37
  Bottom Layer w0.254: v1(102.72,84.5) 108.54,84.5 U12.2 ; 103.84,84.47 103.84,64.11 102.46,62.73 79.25,62.73 78.29,61.76 78.29,55.59 v1(77.67,54.98)
SWDIO: length 201.3
  Top Layer w0.254: v1(77.47,55.66) U3.34 67.19,55.66 66.45,54.91 v1(66.45,45.06)
  Bottom Layer w0.254: U12.4 102.73,89.77 101.65,88.7 101.65,64.77 100.28,63.39 79.1,63.39 77.47,61.76 v1(77.47,55.66) ; v1(66.45,45.06) 66.45,28.4 67.82,27.03 100.58,27.03 102.72,24.89 102.72,4.93 100.14,2.35 H12.1
SWDIO_BUS: length 169.3
  Top Layer w0.254: CN11.a16 CN11.b16 78.06,85.45 104.44,85.45 105.11,84.79 105.11,50.24 107.39,47.96 111.78,47.96 113.12,46.61 113.12,9.69 107.82,4.39 60.54,4.39 H12.2
UART2_RX: length 48.2
  Top Layer w0.254: U3.13 82.77,62.91 83.11,63.25 90.32,63.25 91.03,63.96 91.03,70.41 90.17,71.27 83.52,71.27 82.35,72.44 82.35,82.04 81.33,83.06 73.56,83.06 72.44,84.18 72.44,85.99 CN11.b14
UART2_TX: length 46.6
  Top Layer w0.254: U3.12 84.27,62.13 84.83,62.69 90.47,62.69 91.64,63.86 91.64,70.56 90.42,71.78 83.72,71.78 82.85,72.64 82.85,82.25 81.53,83.57 75.54,83.57 74.96,84.15 CN11.b15
UART5_RX: length 56.5
  Top Layer w0.254: U3.40 78.77,41.72 80.01,40.49 96.11,40.49 97.03,39.57 97.03,26.01 98.36,24.68 CN10.4
UART5_TX: length 59.7
  Top Layer w0.254: CN10.3 97.45,22.18 96.42,23.22 96.42,39.27 95.71,39.98 79.65,39.98 78.27,41.36 U3.39
VC1: length 19.8
  Top Layer w0.254: R24.2 36.32,65.17 36.32,59.03 37.85,57.51 42.98,57.51 43.59,56.9 43.59,55.22 45.26,53.54 C22.1
VC2: length 19.1
  Top Layer w0.254: C23.1 44.78,55.55 44.15,56.18 44.15,57.51 43.56,58.09 38.13,58.09 36.98,59.23 36.98,61.03 36.97,61.05 36.97,64.6 37.6,65.23 R25.2
VC3: length 17.7
  Top Layer w0.254: R26.2 39.88,65.23 38.96,64.31 38.2,64.31 37.62,63.73 37.62,59.61 38.61,58.62 43.79,58.62 44.86,57.56 46.64,57.56 C24.1
VC4: length 18.3
  Top Layer w0.254: R27.2 42.88,65.23 42.88,64.21 42.42,63.75 38.81,63.75 38.27,63.21 38.27,59.78 38.86,59.18 43.94,59.18 44.32,59.56 C25.1
VSOLAR: length 297.5
  Top Layer w0.254: C34.1 49.53,19.25 50.07,19.8 LED24.1 50.07,23.77 LED23.1 50.12,28.16 48.98,29.3 R53.2
  Top Layer w0.343: U11.15 36.37,22 36.83,22.45 36.83,27.28 36.27,27.84 34.19,27.84 33.78,28.24 33.78,29.41 34.34,29.97 37.74,29.97 38.3,30.53 38.3,32.51
  Top Layer w1.016: 38.63,32.77 38.61,32.79 v2(38.61,35.1) v2(38.61,36.41) ; 38.63,32.77 41.3,32.77 42.22,31.85 42.22,29.33 R53.2 ; 38.63,32.77 35.66,32.77 35.04,32.14 Q11.2 ; CN7.1 96.95,99.17 96.95,90.25 94.06,87.35 82.37,87.35 77.72,92 58.39,92 54.94,88.55 CN11.a7 CN11.b7
  Bottom Layer w1.016: CN7.1 110.9,99.23 115.27,94.86 115.27,32.92 111.4,29.06 73.2,29.06 69.87,32.39 69.87,43.87 67.43,46.31 43.16,46.31 38.61,41.76 v2(38.61,36.41) v2(38.61,35.1)
$1N3705: length 7.5
  Top Layer w0.254: R12.1 81.74,47.4 80.77,48.36 U3.44
$1N4664: length 8.1
  Top Layer w0.254: 87.92,57.86 87.92,57.86 88.75,57.86 89.87,58.98 X1.2 ; U3.6 85.97,57.16 86.66,57.86 87.92,57.86
$1N4673: length 8.1
  Top Layer w0.254: U3.5 85.96,56.66 86.66,55.96 C17.2 88.77,55.96 89.85,54.88 X1.1
$1N5322: length 2.5
  Top Layer w0.254: R2.1 87.47,45.23 LED25.1
$1N5324: length 2.5
  Top Layer w0.254: R3.1 87.47,42.64 LED22.1
$1N6913: length 2.7
  Top Layer w0.254: LED26.1 109.11,39.88 109.11,41.99 R11.2
$1N6914: length 7.5
  Top Layer w0.254: R11.1 103.81,42.25 H8.2
  Top Layer w0.531: H8.2 103.74,42.16 Q2.3
$1N6917: length 6.4
  Top Layer w0.254: Q4.3 102.24,38.28 102.79,37.72 Q2.1 102.84,36.03 R9.1
$1N6919: length 3.3
  Top Layer w0.254: R14.1 101.09,35.05 100.1,36.04 99.42,36.04 Q4.1
$1N8647: length 5.8
  Top Layer w0.254: C34.2 42.77,19.25 42.01,20.02 42.01,20.68 41.34,21.35 U11.1
$1N8648: length 12.5
  Top Layer w0.254: Q11.1 36.41,28.97 37.34,28.04 37.34,22 36.69,21.35 U11.16
$1N8650: length 4.7
  Top Layer w0.254: U11.5 42.09,23.95 42.6,23.44 R54.1
$1N8651: length 2.6
  Top Layer w0.254: LED23.2 47.64,23.44 R54.2
$1N8653: length 4.8
  Top Layer w0.254: U11.6 42.02,24.6 42.67,25.25 R58.1
$1N8654: length 6.8
  Top Layer w0.254: U11.7 41.6,25.25 42.19,25.83 R53.1 44.13,27.8 R60.2
$1N8657: length 5.2
  Top Layer w0.254: U11.8 39.58,25.91 38.2,25.91 37.85,26.26 37.85,27.38 38.31,27.85 C38.2
$1N8658: length 3.6
  Top Layer w1.016: Q11.3 32.83,33.33 D7.1
$1N8659: length 11.1
  Top Layer w1.016: D7.2 24.4,33.42 D8.2 23.33,34.49 18.72,34.49 L1.1
$1N8664: length 5.9
  Top Layer w0.254: U11.11 31.35,24.6 30.43,23.67 C36.2
$1N8666: length 2.1
  Top Layer w0.254: R59.2 28.05,27.89 C39.2
$1N8668: length 4.3
  Top Layer w0.254: U11.9 29.57,25.9 R59.1
$1N8669: length 14.7
  Top Layer w0.254: U11.10 30.94,25.25 30.28,24.59 28.45,24.59 27.77,23.91 C35.1 25.27,21.63 R55.2 24.72,21.68 R61.1
$1N14323: length 6.2
  Top Layer w0.254: R22.2 39.06,51.16 36.97,53.25 36.97,55.32
$1N14342: length 30.6
  Top Layer w0.254: v1(40.08,48.41) 39.1,48.41 R22.1 ; U6.4 27.67,62.29 28.6,61.37 32.21,61.37 32.82,60.76 32.82,55.88 31.48,54.55 31.48,51.73 v1(32.51,51.73)
  Bottom Layer w0.254: v1(32.51,51.73) 39.51,51.73 40.08,51.16 v1(40.08,48.41)
$1N14974: length 11.2
  Top Layer w0.254: 39.57,61.05 39.57,62.28 40.08,62.79 46.63,62.79 47.28,63.43 R31.2
$1N15062: length 9.7
  Top Layer w0.254: 38.92,61.05 38.92,62.85 39.37,63.3 44.5,63.3 45.07,63.87 R32.2
$1N15216: length 34.9
  Top Layer w0.254: U10.1 35.67,52.28 34.73,51.34 R21.2 34.05,49.96 34.02,49.94 25.65,49.94 25.16,50.43 25.16,53.88 24.54,54.51 20.83,54.51 20.07,55.27 20.07,60.81 21.35,62.09 U5.4
$1N15258: length 5.6
  Top Layer w0.254: R20.1 36.9,51.65 36.32,52.23 U10.2
$1N15281: length 9.3
  Top Layer w0.254: U10.5 38.27,53.53 39.52,52.27 42.52,52.27 43.5,51.29 C27.2
$1N15285: length 10.8
  Top Layer w0.254: U10.6 38.92,53.96 38.91,53.95 38.91,53.7 39.78,52.83 42.93,52.83 45.68,50.07 C28.2
$1N15289: length 37.2
  Top Layer w0.254: C28.1 49.72,50.07 50.39,50.75 50.39,65.29 52.42,65.29 R34.2 ; C28.1 48.01,50.1 48.01,51 47.45,51.56 45.21,51.56 43.43,53.34 40.18,53.34 39.57,53.95 U10.7 ; C28.1 48.01,50.05 48.01,48.77 47.75,48.51 C27.1
$1N15300: length 7.7
  Top Layer w0.254: R33.2 41.23,51.28 40.79,51.71 39.32,51.71 37.62,53.41 U10.4
$1N15382: length 31.2
  Top Layer w0.343: R44.2 25.35,25.91 26.11,26.67 26.11,29.01 26.77,29.67 30.38,29.67 31.19,28.85 31.19,27.28 31.85,26.62 35.56,26.62 36.12,26.06 36.12,23.88 35.54,23.3 U11.13
  Top Layer w1.016: L1.2 18.03,28.94 R44.2
$1N18401: length 2.7
  Top Layer w0.254: R39.2 8.99,12.14 LED19.1
$1N18481: length 2.7
  Top Layer w0.254: R40.2 11.63,12.14 LED20.1
$1N27506: length 1.1
  Top Layer w0.254: U4.10 18.42,83.72
$1N113442: length 2.6
  Top Layer w0.254: R65.2 17.62,42.09 17.62,40.08 LED27.1
$1N113445: length 7.1
  Top Layer w0.254: Q14.3 10.8,47.31 10.35,47.77 Q13.1
  Top Layer w0.531: R63.1 10.35,51.47 Q13.1
$1N113447: length 6.5
  Top Layer w0.254: Q14.1 15.31,49.51 15.96,48.86 R64.1
$1N113450: length 11.2
  Top Layer w0.254: R65.1 15.88,42.17 H10.2
  Top Layer w0.531: H10.2 10.46,42.17 9.4,43.23 Q13.3
$1N168546: length 2.4
  Top Layer w0.254: R61.2 R68.1
$1N218502: length 5.5
  Top Layer w0.254: U11.4 41.27,23.3 41.81,22.76 41.81,22.2 42.32,21.69 R69.1
$1N218632: length 2.7
  Top Layer w0.254: R71.1 14.28,12.14 LED21.1
$1N223683: length 2.5
  Top Layer w0.254: LED24.2 47.57,21.69 R69.2

## Copper pours and planes (outline as drawn; the poured copper is in the pictures)
AGND on Top Layer: 16.63,73.79 54.11,73.79 54.11,45.4 16.63,45.4
AGND on Bottom Layer: 16.63,73.76 54.11,73.76 54.11,45.36 16.63,45.36
GND on Top Layer: -14.27,118.62 135.99,118.62 135.99,-8.99 -14.27,-8.99
GND on Bottom Layer: -19.25,120.35 142.75,120.35 142.75,-14.68 -19.25,-14.68
V3.3V on Top Layer: 76,36.07 94.95,36.07 94.95,30.18 76,30.18
V5V on Top Layer: 81.34,17.83 94.79,17.83 94.79,14.43 81.34,14.43
VBUS on Top Layer: 52.32,37.59 61.11,37.59 61.11,19.16 52.32,19.16
VBUS on Bottom Layer: 12.65,99.57 53.34,99.57 53.34,81.74 12.65,81.74
VCC on Top Layer: 19.82,98.96 43.23,98.96 43.23,83.57 19.82,83.57
B1 on Top Layer: 25.1,12.45 52.38,12.45 52.38,8.84 25.1,8.84
B2 on Bottom Layer: 43.99,78.38 73.1,78.38 73.1,74.63 43.99,74.63
B3 on Top Layer: 64.69,12.52 91.97,12.52 91.97,8.92 64.69,8.92
B+ on Top Layer: 27.08,55.22 30.84,55.22 30.84,50.34 27.08,50.34
B+ on Top Layer: 28.3,67.82 37.49,67.82 37.49,63.55 28.3,63.55
B+ on Bottom Layer: 26.82,66.24 37.39,66.24 37.39,53.56 26.82,53.56
B- on Top Layer: 25.35,77.67 33.99,77.67 33.99,66.7 25.35,66.7
P+ on Top Layer: 7.52,85.98 12.6,85.98 12.6,83.26 7.52,83.26
P+ on Top Layer: 21.95,66.24 25.91,66.24 25.91,62.18 21.95,62.18
P+ on Top Layer: 20.61,53.04 38.07,53.04 38.07,47.14 20.61,47.14
P+ on Bottom Layer: 20.32,63.91 26.16,63.91 26.16,49.07 20.32,49.07
$1N13839 on Top Layer: 20.57,60.66 32.21,60.66 32.21,55.88 20.57,55.88
$1N27506 on Top Layer: 7.72,91.9 19.3,91.9 19.3,83.67 7.72,83.67
$1N219757 on Top Layer: 61.86,21.91 67.09,21.91 67.09,19.31 61.86,19.31
$1N219761 on Top Layer: 64.67,17.68 79.55,17.68 79.55,14.58 64.67,14.58
$1N219976 on Top Layer: 60.15,37.64 65.38,37.64 65.38,35.05 60.15,35.05
$1N223906 on Top Layer: 63.09,33.38 79.04,33.38 79.04,30.18 63.09,30.18

Small or netless copper shapes (teardrops, artwork), in the pictures only: 395 on Top Layer, 50 on Bottom Layer

## Text on the board
Bottom Silkscreen Layer: + | <-> | - | <+>
Top Silkscreen Layer: LEDR | LEDG | ON/OFF | 1 | CHARGE | - | + | 加热 | 5V | 3.3V | 温测 | 充电 | 0 | 烧录跳线 | 保险丝 | 模数地 | SWCLK | SWDIO | NRST | GND | RX | TX | 板载烧录 | 复位 | 串口 | VBUS
